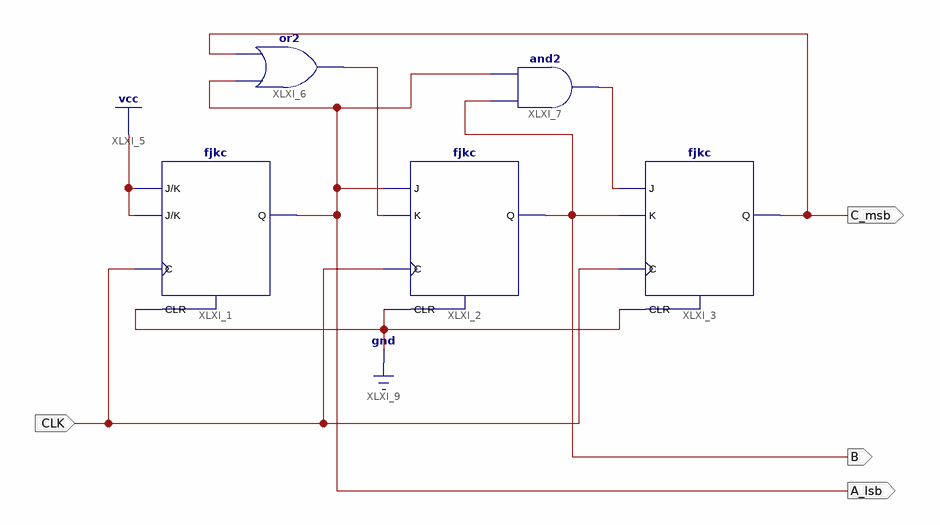
[diagram p0: schematic sheet 1]
// Xilinx ISE schematic counter1_6.sch (spartan6) as structural Verilog: 5 symbols, 4 ports
module counter1_6 (
  input  CLK,
  output A_lsb,
  output C_msb,
  output B
);

  wire XLXN_3, XLXN_9;

  fjkc XLXI_1 (.C(CLK), .CLR(1'b0), .J(1'b1), .K(1'b1), .Q(A_lsb));
  fjkc XLXI_2 (.C(CLK), .CLR(1'b0), .J(A_lsb), .K(XLXN_3), .Q(B));
  fjkc XLXI_3 (.C(CLK), .CLR(1'b0), .J(XLXN_9), .K(B), .Q(C_msb));
  or XLXI_6 (XLXN_3, A_lsb, C_msb);
  and XLXI_7 (XLXN_9, B, A_lsb);
endmodule
